# Altium schematic sheet Ethernet_RTL8201CL.SchDoc: Ethernet Interface
size A3; SheetNumber: 1; SheetTotal: 100; Organization: Altium Limited.; Address1: Level 3, 12a Rodborough Rd; Address2: Frenchs Forest 2086; Address3: NSW; Address4: AUSTRALIA
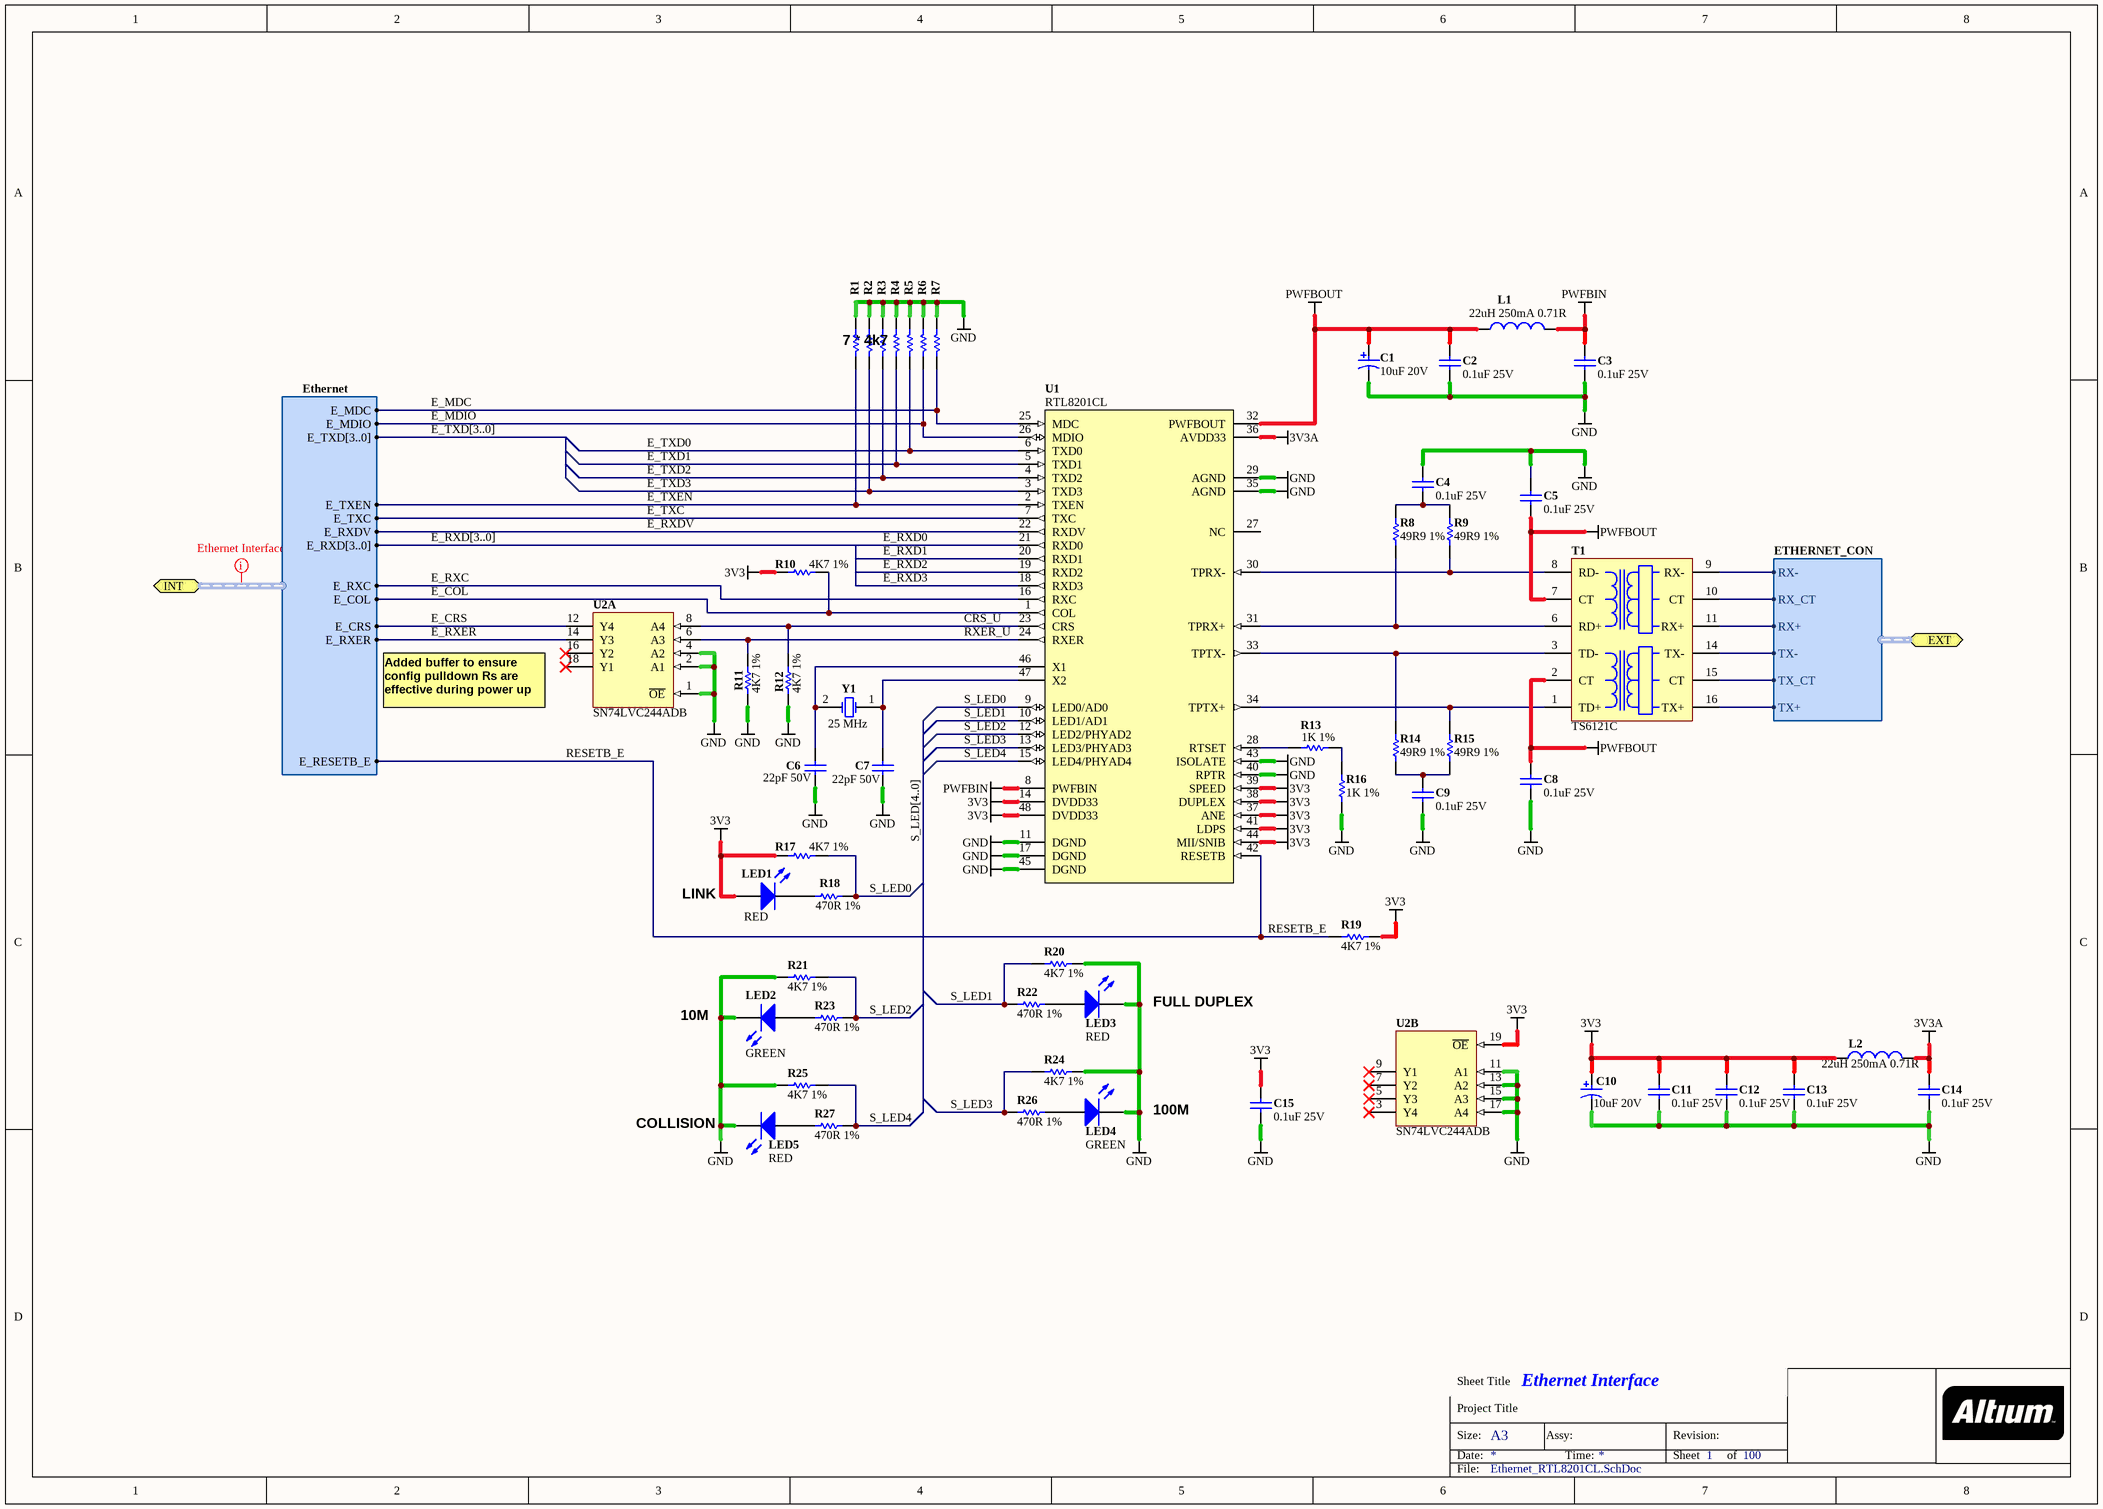
[diagram p0: Ethernet_RTL8201CL.SchDoc]

## Parts
C1  10uF 20V  [CAPC3528-STAR]
C2  0.1uF 25V  [CAPC1005-STAR]
C3  0.1uF 25V  [CAPC1005-STAR]
C4  0.1uF 25V  [CAPC1005-STAR]
C5  0.1uF 25V  [CAPC1005-STAR]
C6  22pF 50V  [CAPC1005-STAR]
C7  22pF 50V  [CAPC1005-STAR]
C8  0.1uF 25V  [CAPC1005-STAR]
C9  0.1uF 25V  [CAPC1005-STAR]
C10  10uF 20V  [CAPC3528-STAR]
C11  0.1uF 25V  [CAPC1005-STAR]
C12  0.1uF 25V  [CAPC1005-STAR]
C13  0.1uF 25V  [CAPC1005-STAR]
C14  0.1uF 25V  [CAPC1005-STAR]
C15  0.1uF 25V  [CAPC1005-STAR]
L1  22uH 250mA 0.71R  [INDC3225]
L2  22uH 250mA 0.71R  [INDC3225]
LED1  RED  [LED2012-STAR]
LED2  GREEN  [LED2012-STAR]
LED3  RED  [LED2012-STAR]
LED4  GREEN  [LED2012-STAR]
LED5  RED  [LED2012-STAR]
R1  4K7 1%  [RESC1005-STAR]  (value not drawn)
R2  4K7 1%  [RESC1005-STAR]  (value not drawn)
R3  4K7 1%  [RESC1005-STAR]  (value not drawn)
R4  4K7 1%  [RESC1005-STAR]  (value not drawn)
R5  4K7 1%  [RESC1005-STAR]  (value not drawn)
R6  4K7 1%  [RESC1005-STAR]  (value not drawn)
R7  4K7 1%  [RESC1005-STAR]  (value not drawn)
R8  49R9 1%  [RESC2012-STAR]
R9  49R9 1%  [RESC2012-STAR]
R10  4K7 1%  [RESC1005-STAR]
R11  4K7 1%  [RESC1005-STAR]
R12  4K7 1%  [RESC1005-STAR]
R13  1K 1%  [RESC1005-STAR]
R14  49R9 1%  [RESC2012-STAR]
R15  49R9 1%  [RESC2012-STAR]
R16  1K 1%  [RESC1005-STAR]
R17  4K7 1%  [RESC1005-STAR]
R18  470R 1%  [RESC1005-STAR]
R19  4K7 1%  [RESC1005-STAR]
R20  4K7 1%  [RESC1005-STAR]
R21  4K7 1%  [RESC1005-STAR]
R22  470R 1%  [RESC1005-STAR]
R23  470R 1%  [RESC1005-STAR]
R24  4K7 1%  [RESC1005-STAR]
R25  4K7 1%  [RESC1005-STAR]
R26  470R 1%  [RESC1005-STAR]
R27  470R 1%  [RESC1005-STAR]
T1  TS6121C  [SOIC127P910-16-TX]
U1  RTL8201CL  [TSQFP50P900X900-48]
U2  SN74LVC244ADB  [SOP65P780-20]  (parts A,B of 2)
Y1  25 MHz  [XTAL_HC49SMD]

## Ports
EXT (harness ETHERNET_CON), INT (harness Ethernet)

## Harnesses
Ethernet: E_MDC, E_MDIO, E_TXD[3..0], E_TXC, E_TXEN, E_RXDV, E_RXD[3..0], E_RESETB_E, E_RXC, E_COL, E_CRS, E_RXER
ETHERNET_CON: TX+, TX-, RX+, RX-, RX_CT, TX_CT

## Nets
3V3: C10.1 C11.2 C12.2 C13.2 C15.2 L2.1 LED1.1(A) R10.2 R17.2 R19.2 U1.14(DVDD33) U1.37(ANE) U1.38(DUPLEX) U1.39(SPEED) U1.41(LDPS) U1.44(MII/SNIB) U1.48(DVDD33) U2.19(~{OE}) U2.20(VCC)
3V3A: C14.2 L2.2 U1.36(AVDD33)
GND: C1.2 C2.1 C3.1 C4.2 C5.2 C6.1 C7.1 C8.1 C9.1 C10.2 C11.1 C12.1 C13.1 C14.1 C15.1 LED2.2(K) LED3.2(K) LED4.2(K) LED5.2(K) R1.2 R2.2 R3.2 R4.2 R5.2 R6.2 R7.2 R11.2 R12.2 R16.1 R20.1 R21.2 R24.1 R25.2 U1.11(DGND) U1.17(DGND) U1.29(AGND) U1.35(AGND) U1.40(RPTR) U1.43(ISOLATE) U1.45(DGND) U2.1(~{OE}) U2.2(A1) U2.4(A2) U2.10(GND) U2.11(A1) U2.13(A2) U2.15(A3) U2.17(A4)
PWFBIN: C3.2 L1.2 U1.8(PWFBIN)
PWFBOUT: C1.1 C2.2 C5.1 C8.2 L1.1 T1.2(CT) T1.7(CT) U1.32(PWFBOUT)
CRS_U: R12.1 U1.23(CRS) U2.8(A4)
E_COL: R10.1 U1.1(COL) ; port INT.E_COL
E_CRS: U2.12(Y4) ; port INT.E_CRS
E_MDC: R7.1 U1.25(MDC) ; port INT.E_MDC
E_MDIO: R6.1 U1.26(MDIO) ; port INT.E_MDIO
E_RXC: U1.16(RXC) ; port INT.E_RXC
E_RXD0: U1.21(RXD0)
E_RXD1: U1.20(RXD1)
E_RXD2: U1.19(RXD2)
E_RXD3: U1.18(RXD3)
E_RXDV: U1.22(RXDV) ; port INT.E_RXDV
E_RXER: U2.14(Y3) ; port INT.E_RXER
E_TXC: U1.7(TXC) ; port INT.E_TXC
E_TXD0: R5.1 U1.6(TXD0)
E_TXD1: R4.1 U1.5(TXD1)
E_TXD2: R3.1 U1.4(TXD2)
E_TXD3: R2.1 U1.3(TXD3)
E_TXEN: R1.1 U1.2(TXEN) ; port INT.E_TXEN
RESETB_E: R19.1 U1.42(RESETB) ; port INT.E_RESETB_E
RXER_U: R11.1 U1.24(RXER) U2.6(A3)
S_LED0: R17.1 R18.1 U1.9(LED0/AD0)
S_LED1: R20.2 R22.1 U1.10(LED1/AD1)
S_LED2: R21.1 R23.1 U1.12(LED2/PHYAD2)
S_LED3: R24.2 R26.1 U1.13(LED3/PHYAD3)
S_LED4: R25.1 R27.1 U1.15(LED4/PHYAD4)
NetC4_1: C4.1 R8.2 R9.2
NetC6_2: C6.2 U1.46(X1) Y1.2(OSC2)
NetC7_2: C7.2 U1.47(X2) Y1.1(OSC1)
NetC9_2: C9.2 R14.1 R15.1
NetLED1_2: LED1.2(K) R18.2
NetLED2_1: LED2.1(A) R23.2
NetLED3_1: LED3.1(A) R22.2
NetLED4_1: LED4.1(A) R26.2
NetLED5_1: LED5.1(A) R27.2
NetR8_1: R8.1 T1.6(RD+) U1.31(TPRX+)
NetR9_1: R9.1 T1.8(RD-) U1.30(TPRX-)
NetR13_1: R13.1 R16.2
NetR13_2: R13.2 U1.28(RTSET)
NetR14_2: R14.2 T1.3(TD-) U1.33(TPTX-)
NetR15_2: R15.2 T1.1(TD+) U1.34(TPTX+)
NetT1_9: T1.9(RX-) ; port EXT.RX-
NetT1_10: T1.10(CT) ; port EXT.RX_CT
NetT1_11: T1.11(RX+) ; port EXT.RX+
NetT1_14: T1.14(TX-) ; port EXT.TX-
NetT1_15: T1.15(CT) ; port EXT.TX_CT
NetT1_16: T1.16(TX+) ; port EXT.TX+

Not connected (* = marked no-connect by the designer): U1 27(NC); U2 3(Y4)* 5(Y3)* 7(Y2)* 9(Y1)* 16(Y2)* 18(Y1)*

## Buses and harness runs
bus E_RXD[3..0]
bus E_TXD[3..0]
bus S_LED[4..0]

## Layout directives
net class Ethernet Interface: (no net found under the mark)

## Notes on the sheet
- (near R1) 7 * 4k7
- (near U2) Added buffer to ensure config pulldown Rs are effective during power up
- (near LED1) LINK
- 10M
- FULL DUPLEX
- COLLISION
- 100M
- Sheet Title
- Project Title
- Size:
- Date:
- A3
- Assy:
- Time:
- Revision:
- Sheet
- of
- File:

## Library data of the parts
C1 C10 = D-101-0007: Capacitor, Tantalum, 10uF 10% 20V MCCT-B (3528); Polarity: Polarized; Capacitance: 10 uF; Category: Capacitor; Mounting Technology: Surface Mount; Rated Voltage: 20 V; Status: Production; Technology: Tantalum; Tolerance: 10 %
C2-C5 C8 C9 C11-C15 = D-101-0045: Capacitor, Ceramic, 0.1uF 25V 0402 (1005); Dielectric: X7R; Polarity: Non-Polarized; Tolerance: 10 %; Capacitance: 0.1 uF; Category: Capacitor; Mounting Technology: Surface Mount; Rated Voltage: 25 V; Status: Deprecated; Technology: Ceramic
C6 C7 = D-101-0059: Capacitor, Ceramic, 22pF 5% 50V 0402 (1005) COG; Polarity: Non-Polarized; Capacitance: 22 pF; Category: Capacitor; Dielectric: COG; Mounting Technology: Surface Mount; Rated Voltage: 50 V; Status: Unreleased; Technology: Ceramic; Tolerance: 5 %
L1 L2 = D-102-0006: Inductor, Coil 22uH  1210 (3225) LQH32CN220K21L; Max Input Current: mA; Category: Inductor; Inductance: 22 uH; Mounting Technology: Surface Mount; Status: Production
LED1 LED3 LED5 = D-153-0003: LED, Red 0805 (2013) HSMH-C170; Brightness: 17.0 mcd; Peak Wave Length: 639 nm; Category: LED; Color: N/A; Mounting Technology: Surface Mount; Status: Production
LED2 LED4 = D-153-0004: LED, Green 0805 (2012) KP-2012SGD; Brightness: 12.5 mcd; Peak Wave Length: 565 nm; Category: LED; Color: N/A; Mounting Technology: Surface Mount; Status: Production
R1-R7 R10-R12 R17 R19-R21 R24 R25 = D-100-0088: Resistor, 4K7 1% 0402 (1005); Power Rating: 63 mW; Resistance: 4.7 K; Category: Resistor; Mounting Technology: Surface Mount; Status: Production; Tolerance: 1 %
R8 R9 R14 R15 = D-100-0017: Resistor, 49R9 1% 0805 (2012); Power Rating: mW; Resistance: 49.9 R; Category: Resistor; Mounting Technology: Surface Mount; Status: Production; Tolerance: 1 %
R13 R16 = D-100-0121: Resistor, 1K 1% 0402 (1005); Power Rating: 63 mW; Category: Resistor; Mounting Technology: Surface Mount; Resistance: 1 K; Status: Production; Tolerance: 1 %
R18 R22 R23 R26 R27 = D-100-0093: Resistor, 470R 1% 0402 (1005); Power Rating: 63 mW; Category: Resistor; Mounting Technology: Surface Mount; Resistance: 470 R; Status: Production; Tolerance: 1 %
T1 = D-107-0001: Transformer, TS6121C Ethernet 10/100; Category: Transformer; Status: Production
U1 = D-221-0000: RTL8201CL-VD, Single-Chip/Single-Port 10/100 Fast Ethernet Phyceiver; Comm Standard: None; Category: IC-Communication; Mounting Technology: Surface Mount; Status: Production
U2 = D-205-0000: SN74LVC244ADBR,  Octal Buffer/Driver with 3-State Outputs, 2.0V - 3.6V; Category: IC-Logic; Status: Production
Y1 = D-103-0003: Crystal, 25 MHz  +/-30ppm 20pf HC49SMD; Frequency Stability: 30 ppm; Nominal Operational Voltage: mV; Category: Crystal; Frequency Tolerance: 30 ppm; Load Capacitance: 20 pF; Mounting Technology: Surface Mount; Nominal Fequency: 25 MHz; Status: Production